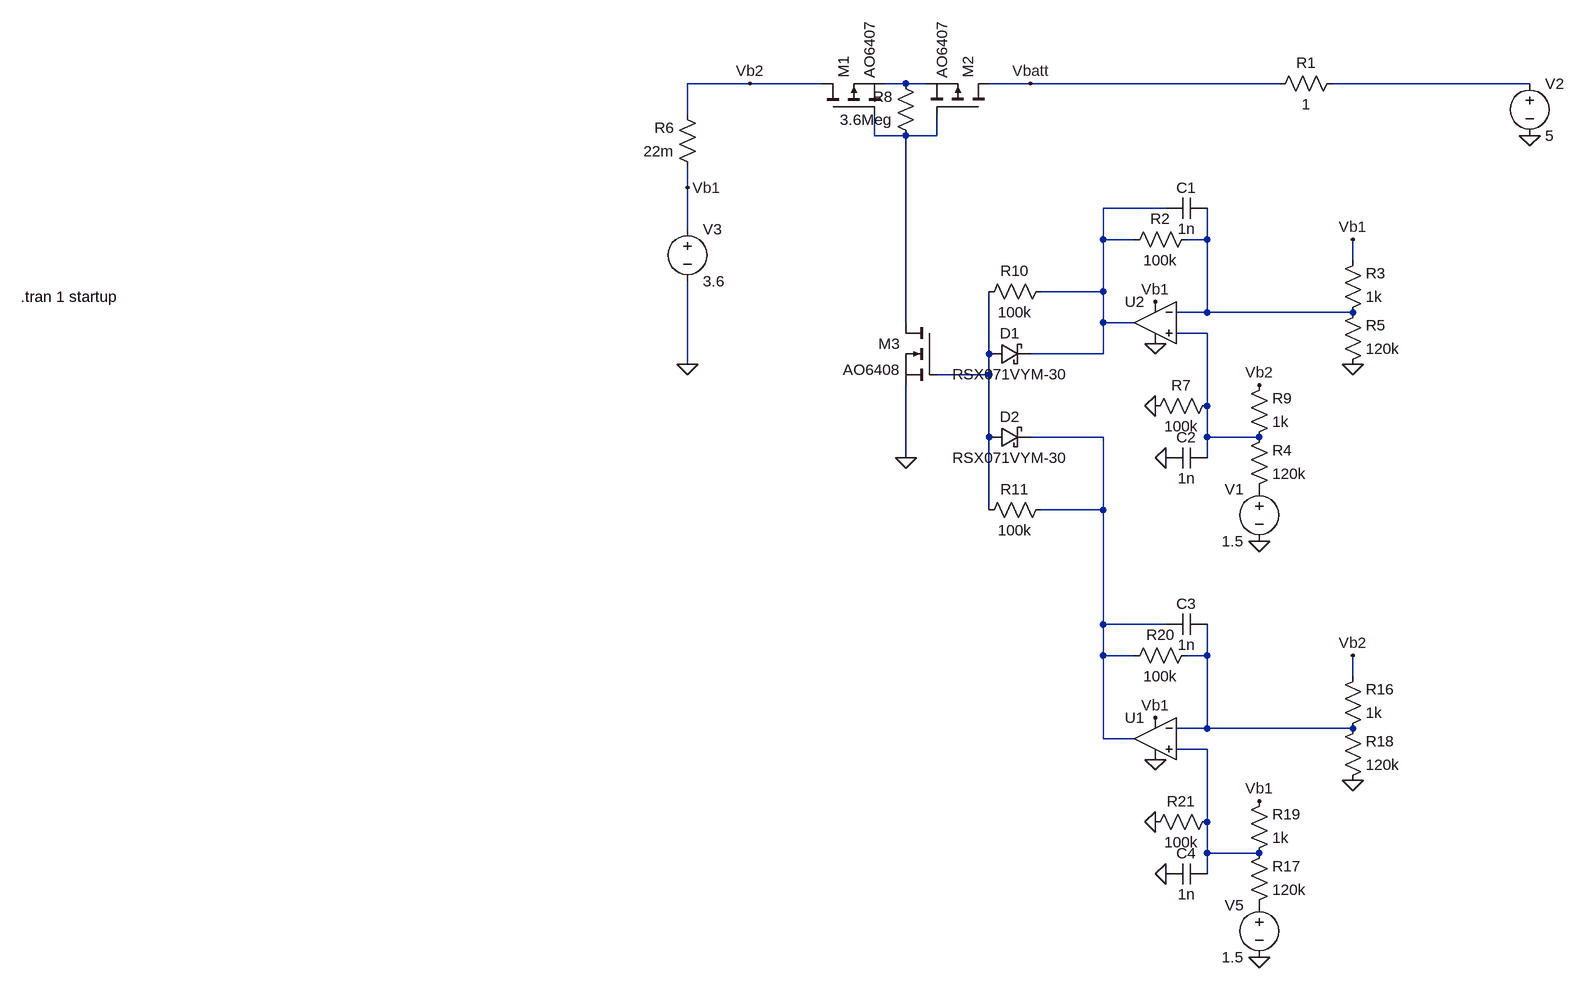
[diagram p0: schematic Draft3.asc]
Draft3.asc, the LTspice schematic file:
Version 4
SHEET 1 2240 1188
WIRE 800 -192 704 -192
WIRE 912 -192 800 -192
WIRE 1040 -192 1008 -192
WIRE 1072 -192 1040 -192
WIRE 1232 -192 1168 -192
WIRE 1616 -192 1232 -192
WIRE 2000 -192 1696 -192
WIRE 704 -144 704 -192
WIRE 992 -112 992 -144
WIRE 1040 -112 992 -112
WIRE 1088 -112 1088 -144
WIRE 1088 -112 1040 -112
WIRE 704 -32 704 -64
WIRE 1440 0 1344 0
WIRE 704 32 704 -32
WIRE 1344 48 1344 0
WIRE 1392 48 1344 48
WIRE 1504 48 1504 0
WIRE 1504 48 1472 48
WIRE 1728 80 1728 48
WIRE 1344 128 1344 48
WIRE 1344 128 1248 128
WIRE 1504 160 1504 48
WIRE 1504 160 1456 160
WIRE 1728 160 1504 160
WIRE 1040 176 1040 -112
WIRE 1344 176 1344 128
WIRE 1392 176 1344 176
WIRE 1504 192 1456 192
WIRE 1168 224 1168 128
WIRE 1344 224 1344 176
WIRE 1344 224 1232 224
WIRE 704 240 704 112
WIRE 1168 256 1168 224
WIRE 1168 256 1088 256
WIRE 1504 304 1504 192
WIRE 1168 352 1168 256
WIRE 1344 352 1232 352
WIRE 1504 352 1504 304
WIRE 1584 352 1504 352
WIRE 1040 384 1040 272
WIRE 1504 384 1504 352
WIRE 1168 464 1168 352
WIRE 1344 464 1344 352
WIRE 1344 464 1248 464
WIRE 1344 640 1344 464
WIRE 1440 640 1344 640
WIRE 1344 688 1344 640
WIRE 1392 688 1344 688
WIRE 1504 688 1504 640
WIRE 1504 688 1472 688
WIRE 1728 720 1728 688
WIRE 1504 800 1504 688
WIRE 1504 800 1456 800
WIRE 1728 800 1504 800
WIRE 1344 816 1344 688
WIRE 1392 816 1344 816
WIRE 1504 832 1456 832
WIRE 1504 944 1504 832
WIRE 1504 992 1504 944
WIRE 1584 992 1504 992
WIRE 1504 1024 1504 992
FLAG 1584 512 0
FLAG 1424 144 Vb1
FLAG 1424 208 0
FLAG 704 240 0
FLAG 1040 384 0
FLAG 704 -32 Vb1
FLAG 800 -192 Vb2
FLAG 1584 272 Vb2
FLAG 1728 48 Vb1
FLAG 1728 240 0
FLAG 1232 -192 Vbatt
FLAG 1424 304 0
FLAG 1440 384 0
FLAG 2000 -112 0
FLAG 1584 1152 0
FLAG 1424 784 Vb1
FLAG 1424 848 0
FLAG 1728 688 Vb2
FLAG 1584 912 Vb1
FLAG 1728 880 0
FLAG 1424 944 0
FLAG 1440 1024 0
SYMBOL voltage 1584 416 M0
WINDOW 123 0 0 Left 0
WINDOW 39 0 0 Left 0
SYMATTR InstName V1
SYMATTR Value 1.5
SYMBOL pmos 912 -144 R270
SYMATTR InstName M1
SYMATTR Value AO6407
SYMBOL res 1712 176 M180
WINDOW 0 36 76 Left 2
WINDOW 3 36 40 Left 2
SYMATTR InstName R3
SYMATTR Value 1k
SYMBOL res 1568 448 M180
WINDOW 0 36 76 Left 2
WINDOW 3 36 40 Left 2
SYMATTR InstName R4
SYMATTR Value 120k
SYMBOL res 1712 256 M180
WINDOW 0 36 76 Left 2
WINDOW 3 36 40 Left 2
SYMATTR InstName R5
SYMATTR Value 120k
SYMBOL res 720 -48 R180
WINDOW 0 36 76 Left 2
WINDOW 3 36 40 Left 2
SYMATTR InstName R6
SYMATTR Value 22m
SYMBOL res 1056 -96 R180
WINDOW 0 36 76 Left 2
WINDOW 3 36 40 Left 2
SYMATTR InstName R8
SYMATTR Value 3.6Meg
SYMBOL voltage 704 16 R0
WINDOW 123 0 0 Left 0
WINDOW 39 0 0 Left 0
SYMATTR InstName V3
SYMATTR Value 3.6
SYMBOL OpAmps\\UniversalOpamp2 1424 176 M0
SYMATTR InstName U2
SYMBOL res 1568 368 M180
WINDOW 0 36 76 Left 2
WINDOW 3 36 40 Left 2
SYMATTR InstName R9
SYMATTR Value 1k
SYMBOL pmos 1168 -144 M270
SYMATTR InstName M2
SYMATTR Value AO6407
SYMBOL nmos 1088 176 M0
SYMATTR InstName M3
SYMATTR Value AO6408
SYMBOL schottky 1168 240 R270
WINDOW 0 32 32 VTop 2
WINDOW 3 0 32 VBottom 2
SYMATTR InstName D1
SYMATTR Value RSX071VYM-30
SYMATTR Description Diode
SYMATTR Type diode
SYMBOL res 1264 112 R90
WINDOW 0 0 56 VBottom 2
WINDOW 3 32 56 VTop 2
SYMATTR InstName R10
SYMATTR Value 100k
SYMBOL res 1264 448 R90
WINDOW 0 0 56 VBottom 2
WINDOW 3 32 56 VTop 2
SYMATTR InstName R11
SYMATTR Value 100k
SYMBOL schottky 1168 368 R270
WINDOW 0 32 32 VTop 2
WINDOW 3 0 32 VBottom 2
SYMATTR InstName D2
SYMATTR Value RSX071VYM-30
SYMATTR Description Diode
SYMATTR Type diode
SYMBOL res 1488 32 R90
WINDOW 0 0 56 VBottom 2
WINDOW 3 32 56 VTop 2
SYMATTR InstName R2
SYMATTR Value 100k
SYMBOL res 1520 288 R90
WINDOW 0 0 56 VBottom 2
WINDOW 3 32 56 VTop 2
SYMATTR InstName R7
SYMATTR Value 100k
SYMBOL cap 1504 -16 R90
WINDOW 0 0 32 VBottom 2
WINDOW 3 32 32 VTop 2
SYMATTR InstName C1
SYMATTR Value 1n
SYMBOL cap 1504 368 R90
WINDOW 0 0 32 VBottom 2
WINDOW 3 32 32 VTop 2
SYMATTR InstName C2
SYMATTR Value 1n
SYMBOL res 1712 -208 R90
WINDOW 0 0 56 VBottom 2
WINDOW 3 32 56 VTop 2
SYMATTR InstName R1
SYMATTR Value 1
SYMBOL voltage 2000 -208 R0
WINDOW 123 0 0 Left 0
WINDOW 39 0 0 Left 0
SYMATTR InstName V2
SYMATTR Value 5
SYMBOL voltage 1584 1056 M0
WINDOW 123 0 0 Left 0
WINDOW 39 0 0 Left 0
SYMATTR InstName V5
SYMATTR Value 1.5
SYMBOL res 1712 816 M180
WINDOW 0 36 76 Left 2
WINDOW 3 36 40 Left 2
SYMATTR InstName R16
SYMATTR Value 1k
SYMBOL res 1568 1088 M180
WINDOW 0 36 76 Left 2
WINDOW 3 36 40 Left 2
SYMATTR InstName R17
SYMATTR Value 120k
SYMBOL res 1712 896 M180
WINDOW 0 36 76 Left 2
WINDOW 3 36 40 Left 2
SYMATTR InstName R18
SYMATTR Value 120k
SYMBOL OpAmps\\UniversalOpamp2 1424 816 M0
SYMATTR InstName U1
SYMBOL res 1568 1008 M180
WINDOW 0 36 76 Left 2
WINDOW 3 36 40 Left 2
SYMATTR InstName R19
SYMATTR Value 1k
SYMBOL res 1488 672 R90
WINDOW 0 0 56 VBottom 2
WINDOW 3 32 56 VTop 2
SYMATTR InstName R20
SYMATTR Value 100k
SYMBOL res 1520 928 R90
WINDOW 0 0 56 VBottom 2
WINDOW 3 32 56 VTop 2
SYMATTR InstName R21
SYMATTR Value 100k
SYMBOL cap 1504 624 R90
WINDOW 0 0 32 VBottom 2
WINDOW 3 32 32 VTop 2
SYMATTR InstName C3
SYMATTR Value 1n
SYMBOL cap 1504 1008 R90
WINDOW 0 0 32 VBottom 2
WINDOW 3 32 32 VTop 2
SYMATTR InstName C4
SYMATTR Value 1n
TEXT -322 136 Left 2 !.tran 1 startup

The netlist it stands for:
* Draft3.asc
V1 P001 0 1.5
M1 Vb2 N003 N001 N001 AO6407
R3 N005 Vb1 1k
R4 P001 N006 120k
R5 0 N005 120k
R6 Vb1 Vb2 22m
R8 N003 N001 3.6Meg
V3 Vb1 0 3.6
XU2 N006 N005 Vb1 0 N004 level.2 Avol=1Meg GBW=10Meg Slew=10Meg ilimit=25m rail=0 Vos=0 phimargin=45 en=0 enk=0 in=0 ink=0 Rin=500Meg  ; pins IN+ IN- V+ V- OUT
R9 N006 Vb2 1k
M2 Vbatt N003 N001 N001 AO6407
M3 N003 N007 0 0 AO6408
D1 N007 N004 RSX071VYM-30
R10 N004 N007 100k
R11 N008 N007 100k
D2 N007 N008 RSX071VYM-30
R2 N005 N004 100k
R7 N006 0 100k
C1 N005 N004 1n
C2 N006 0 1n
R1 N002 Vbatt 1
V2 N002 0 5
V5 P002 0 1.5
R16 N009 Vb2 1k
R17 P002 N010 120k
R18 0 N009 120k
XU1 N010 N009 Vb1 0 N008 level.2 Avol=1Meg GBW=10Meg Slew=10Meg ilimit=25m rail=0 Vos=0 phimargin=45 en=0 enk=0 in=0 ink=0 Rin=500Meg  ; pins IN+ IN- V+ V- OUT
R19 N010 Vb1 1k
R20 N009 N008 100k
R21 N010 0 100k
C3 N009 N008 1n
C4 N010 0 1n
.model D D
.lib standard.dio
.model NMOS NMOS
.model PMOS PMOS
.lib standard.mos
.tran 1 startup
.lib UniversalOpamps2.sub
.backanno
.end